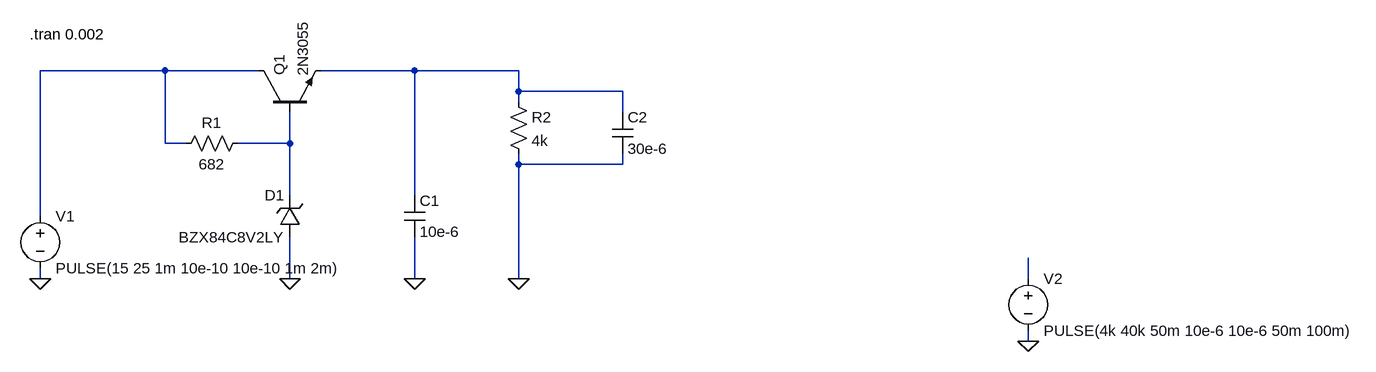
[diagram p0: schematic Draft4.asc]
Draft4.asc, the LTspice schematic file:
Version 4.1
SHEET 1 2124 680
WIRE 256 -64 64 -64
WIRE 400 -64 256 -64
WIRE 640 -64 496 -64
WIRE 800 -64 640 -64
WIRE 800 -32 800 -64
WIRE 960 -32 800 -32
WIRE 800 -16 800 -32
WIRE 960 0 960 -32
WIRE 256 48 256 -64
WIRE 288 48 256 48
WIRE 448 48 448 0
WIRE 448 48 368 48
WIRE 800 80 800 64
WIRE 960 80 960 64
WIRE 960 80 800 80
WIRE 448 128 448 48
WIRE 640 128 640 -64
WIRE 64 160 64 -64
WIRE 64 256 64 240
WIRE 448 256 448 192
WIRE 640 256 640 192
WIRE 800 256 800 80
WIRE 1584 256 1584 224
WIRE 1584 352 1584 336
FLAG 64 256 0
FLAG 448 256 0
FLAG 640 256 0
FLAG 800 256 0
FLAG 1584 352 0
SYMBOL voltage 64 144 R0
SYMATTR InstName V1
SYMATTR Value PULSE(15 25 1m 10e-10 10e-10 1m 2m)
SYMBOL res 384 32 R90
WINDOW 0 0 56 VBottom 2
WINDOW 3 32 56 VTop 2
SYMATTR InstName R1
SYMATTR Value 682
SYMBOL npn 400 0 R270
SYMATTR InstName Q1
SYMATTR Value 2N3055
SYMBOL zener 464 192 R180
WINDOW 0 24 64 Left 2
WINDOW 3 24 0 Left 2
SYMATTR InstName D1
SYMATTR Value BZX84C8V2LY
SYMBOL cap 624 128 R0
SYMATTR InstName C1
SYMATTR Value 10e-6
SYMBOL res 784 -32 R0
SYMATTR InstName R2
SYMATTR Value 4k
SYMBOL voltage 1584 240 R0
SYMATTR InstName V2
SYMATTR Value PULSE(4k 40k 50m 10e-6 10e-6 50m 100m)
SYMBOL cap 944 0 R0
SYMATTR InstName C2
SYMATTR Value 30e-6
TEXT 48 -120 Left 2 !.tran 0.002

The netlist it stands for:
* Draft4.asc
V1 N001 0 PULSE(15 25 1m 10e-10 10e-10 1m 2m)
R1 N003 N001 682
Q1 N001 N003 N002 0 2N3055
D1 0 N003 BZX84C8V2LY
C1 N002 0 10e-6
R2 N002 0 4k
V2 N004 0 PULSE(4k 40k 50m 10e-6 10e-6 50m 100m)
C2 N002 0 30e-6
.model D D
.lib standard.dio
.model NPN NPN
.model PNP PNP
.lib standard.bjt
.tran 0.002
.backanno
.end